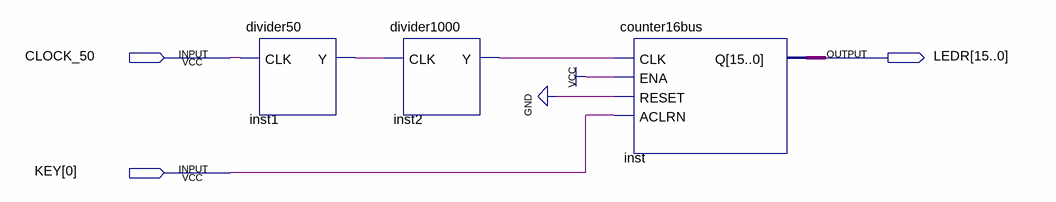
[diagram p0: schematic sheet]
// Quartus schematic test_counter16bus.bdf as structural Verilog: 3 symbols, 3 pins
module test_counter16bus (
  input  CLOCK_50,
  input  [0:0] KEY,
  output [15:0] LEDR
);

  wire inst1_y, inst2_y;

  divider50 inst1 (.CLK(CLOCK_50), .Y(inst1_y));
  divider1000 inst2 (.CLK(inst1_y), .Y(inst2_y));
  counter16bus inst (.CLK(inst2_y), .ENA(1'b1), .RESET(1'b0), .ACLRN(KEY[0]), .Q(LEDR));
endmodule
